# EAGLE design v2.0 (EAGLE 9.4.2)
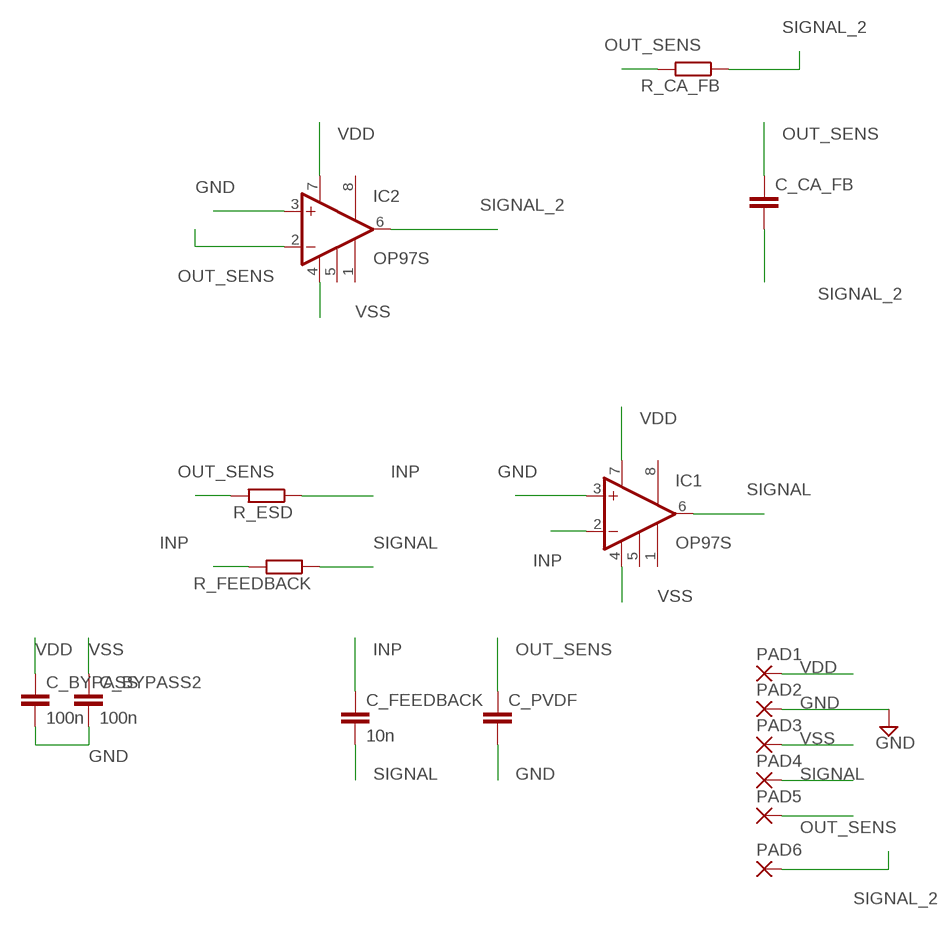
[diagram p0: schematic, sheet 1]

## Parts
C_BYPASS  100n  C-EUC0805  [C0805]
C_BYPASS2  100n  C-EUC0805  [C0805]
C_CA_FB  C-EUC0805  [C0805]
C_FEEDBACK  10n  C-EUC0805  [C0805]
C_PVDF  C-EUC0805  [C0805]
IC1  OP97S  [SO08]
IC2  OP97S  [SO08]
PAD1  SMD5  [SMD2,54-5,08]
PAD2  SMD5  [SMD2,54-5,08]
PAD3  SMD5  [SMD2,54-5,08]
PAD4  SMD5  [SMD2,54-5,08]
PAD5  SMD5  [SMD2,54-5,08]
PAD6  SMD5  [SMD2,54-5,08]
R_CA_FB  10k  R-EU_M0805  [M0805]
R_ESD  5k  R-EU_M0805  [M0805]
R_FEEDBACK  100M  R-EU_M0805  [M0805]

## Nets
GND: C_BYPASS2.2 C_BYPASS.2 C_PVDF.2 IC1.3(+IN) IC2.3(+IN) PAD2.1(P)
INP: C_FEEDBACK.1 IC1.2(-IN) R_ESD.1 R_FEEDBACK.2
OUT_SENS: C_CA_FB.1 C_PVDF.1 IC2.2(-IN) PAD5.1(P) R_CA_FB.2 R_ESD.2
SIGNAL: C_FEEDBACK.2 IC1.6(OUT) PAD4.1(P) R_FEEDBACK.1
SIGNAL_2: C_CA_FB.2 IC2.6(OUT) PAD6.1(P) R_CA_FB.1
VDD: C_BYPASS.1 IC1.7(V+) IC2.7(V+) PAD1.1(P)
VSS: C_BYPASS2.1 IC1.4(V-) IC2.4(V-) PAD3.1(P)
Unconnected: IC1.1(BAL1) IC1.5(COMP) IC1.8(BAL2) IC2.1(BAL1) IC2.5(COMP) IC2.8(BAL2)

## Library data of the parts
C_BYPASS C_BYPASS2 = resistor:C-EU: CAPACITOR, European symbol
C_CA_FB C_FEEDBACK C_PVDF = rcl:C-EU: CAPACITOR, European symbol; SPICEPREFIX: C
IC1 IC2 = linear:OP97: Low Power, High Precision Operational Amplifier Source: http://www.analog.com/static/imported-files/data_sheets/OP97.pdf
PAD1-PAD6 = wirepad:SMD5: SMD PAD
R_CA_FB R_ESD R_FEEDBACK = rcl:R-EU_: RESISTOR, European symbol; SPICEPREFIX: R

## Board
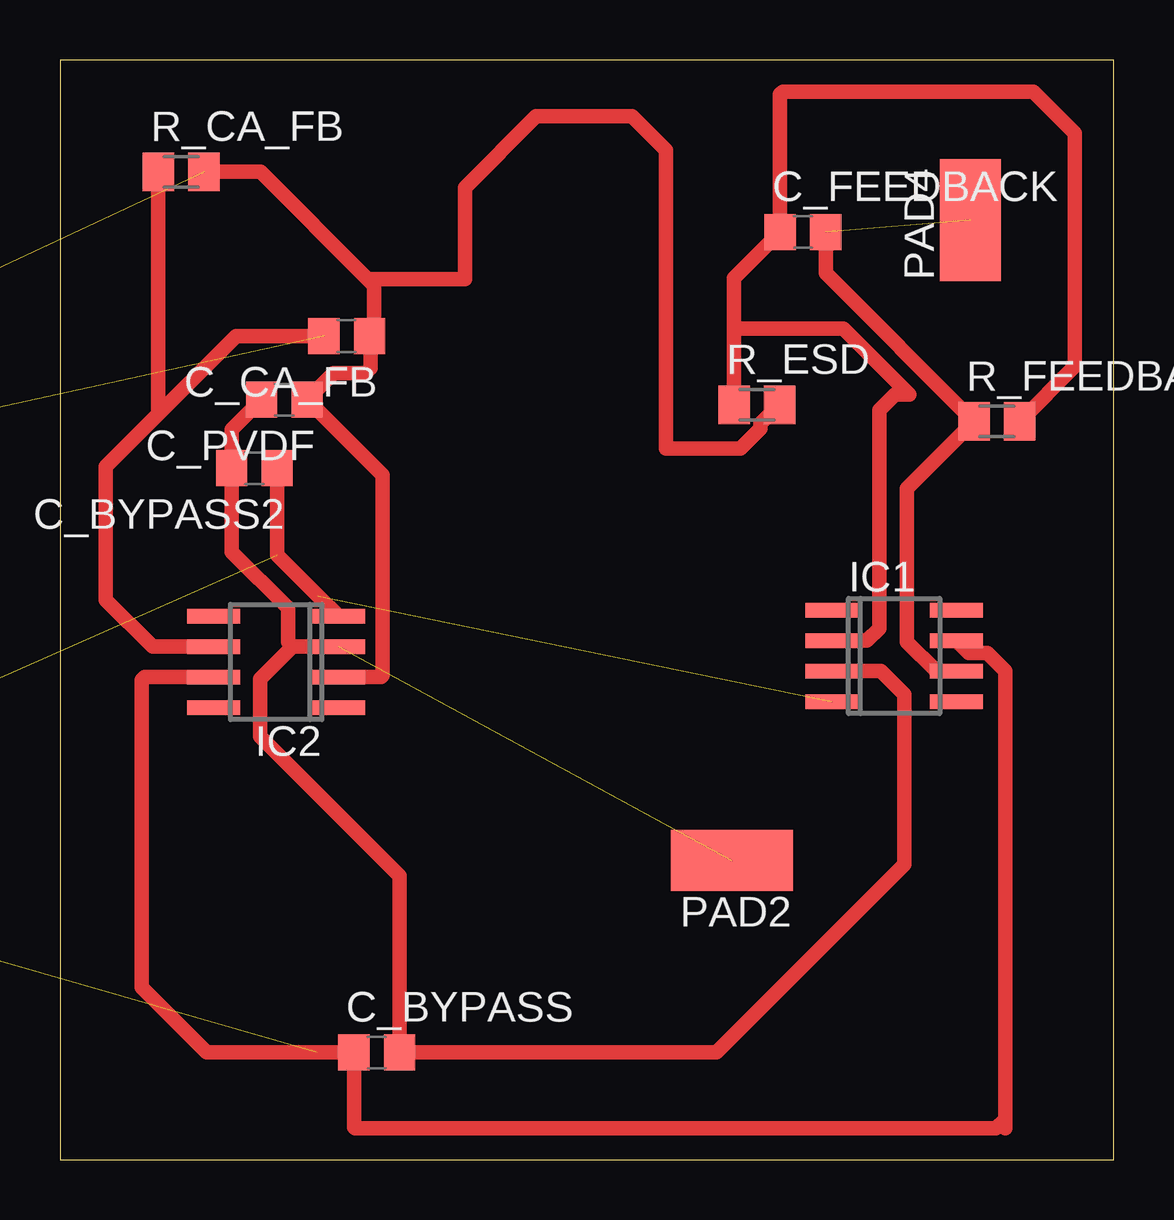
[diagram p1: board, top side]

Size 43.93 x 45.85 mm. Coordinates in mm from the lower left corner, seen from the top.
Outline: 0,0 43.93,0 43.93,45.85 0,45.85 0,0
Copper layers (1*16): Top 0.035mm / dielectric 1.5mm / Bottom 0.035mm
Design rules "default": minimum track width 6mil, minimum drill 0.35mm, track to track 6mil, track to pad 6mil, pad to pad 6mil, via to via 6mil, smd to smd 6mil, copper to edge 40mil, drill to drill 6mil, minimum pad ring 10mil, minimum via ring 8mil, stop-mask expansion 4mil, vias tented up to drill 0mil, thermal gap 10mil

### Footprints (pad centres in the part's own frame; a part is rotated, then mirrored left to right if it is on the bottom)
C0805 = smd 1.3 x 1.5: 1 -0.95,0; 2 0.95,0
SO08 = smd 0.6 x 2.2: 1 -1.905,-2.6; 2 -0.635,-2.6; 3 0.635,-2.6; 4 1.905,-2.6; 5 1.905,2.6; 6 0.635,2.6; 7 -0.635,2.6; 8 -1.905,2.6
SMD2,54-5,08 = smd 2.54 x 5.08: 1 0,0
M0805 = smd 1.3 x 1.6: 1 -0.95,0; 2 0.95,0

### Placement (x,y rotation side)
C_BYPASS  13.2,4.48 0 top
C_BYPASS2  8.1,28.83 180 top
C_CA_FB  11.95,34.34 180 top
C_FEEDBACK  30.97,38.68 0 top
C_PVDF  9.35,31.69 180 top
IC1  34.77,21.01 270 top
IC2  9.01,20.76 90 top
PAD1  -35.56,17.78 0 top  (outside the outline)
PAD2  28.01,12.48 90 top
PAD3  -19.17,12.73 0 top  (outside the outline)
PAD4  37.95,39.18 0 top
PAD5  -30.48,24.13 0 top  (outside the outline)
PAD6  -35.56,24.13 0 top  (outside the outline)
R_CA_FB  5.05,41.19 0 top
R_ESD  29.05,31.48 0 top
R_FEEDBACK  39.05,30.78 0 top

### Tracks (layer width: path | path; a pad name or v marks a point on that pad's centre or on a via)
GND  (1 unrouted)
  Top 0.61: 14.2,4.53 C_BYPASS.2 | IC2.3 9.7,21.4 | C_BYPASS.2 27.37,4.48 35.2,12.31 35.2,19.4 34.23,20.38 IC1.3 | 9.7,21.4 9.5,21.6 9.5,23 7.15,25.35 C_BYPASS2.2 7.15,30.44 C_PVDF.2 | C_BYPASS.2 14.15,11.85 8.35,17.65 8.35,20.05 9.7,21.4
INP
  Top 0.61: R_ESD.1 28.1,34.65 | 28.1,34.65 28.1,36.76 C_FEEDBACK.1 30.02,44.42 30.13,44.53 40.57,44.53 42.3,42.8 42.3,33.08 R_FEEDBACK.2 | IC1.2 33.65,21.64 34.15,22.15 34.15,31.25 34.8,31.9 35.4,31.9 32.65,34.65 28.1,34.65
OUT_SENS  (1 unrouted)
  Top 0.61: R_CA_FB.2 8.36,41.19 12.82,36.73 | 12.82,36.73 13.1,36.45 13.1,34.54 12.96,34.4 | 12.96,34.4 C_CA_FB.1 | 12.82,36.73 16.89,36.73 16.89,40.53 19.85,43.5 23.85,43.5 25.25,42.1 25.25,29.65 28.37,29.65 29.21,30.49 29.21,30.69 R_ESD.2 | 12.96,34.4 12.96,33.01 12.75,32.8 11.41,32.8 C_PVDF.1 13.45,28.54 13.45,20.2 13.38,20.12 IC2.2
SIGNAL  (1 unrouted)
  Top 0.61: C_FEEDBACK.2 31.92,36.96 R_FEEDBACK.1 35.3,27.98 35.3,21.6 36.52,20.38 IC1.6
SIGNAL_2  (1 unrouted)
  Top 0.61: R_CA_FB.1 4.1,31.1 | 4.1,31.1 1.9,28.9 1.9,23.35 3.85,21.39 IC2.6 | 4.1,31.1 7.34,34.34 C_CA_FB.2
VDD  (1 unrouted)
  Top 0.61: IC2.7 3.52,20.12 3.4,20 3.4,7.2 6.12,4.48 10.7,4.48 C_BYPASS.1 12.25,1.37 12.3,1.32 39.02,1.32 39.4,1.7 | IC1.7 37.88,21.13 38.66,21.13 39.4,20.39 39.4,1.7 | 39.4,1.7 39.4,1.32
VSS  (2 unrouted)
  Top 0.61: C_BYPASS2.1 9.05,25.23 10.76,23.51 IC2.4 | IC1.4